# Altium schematic sheet Amplifier.SchDoc
size A; SheetNumber: 3; SheetTotal: 5
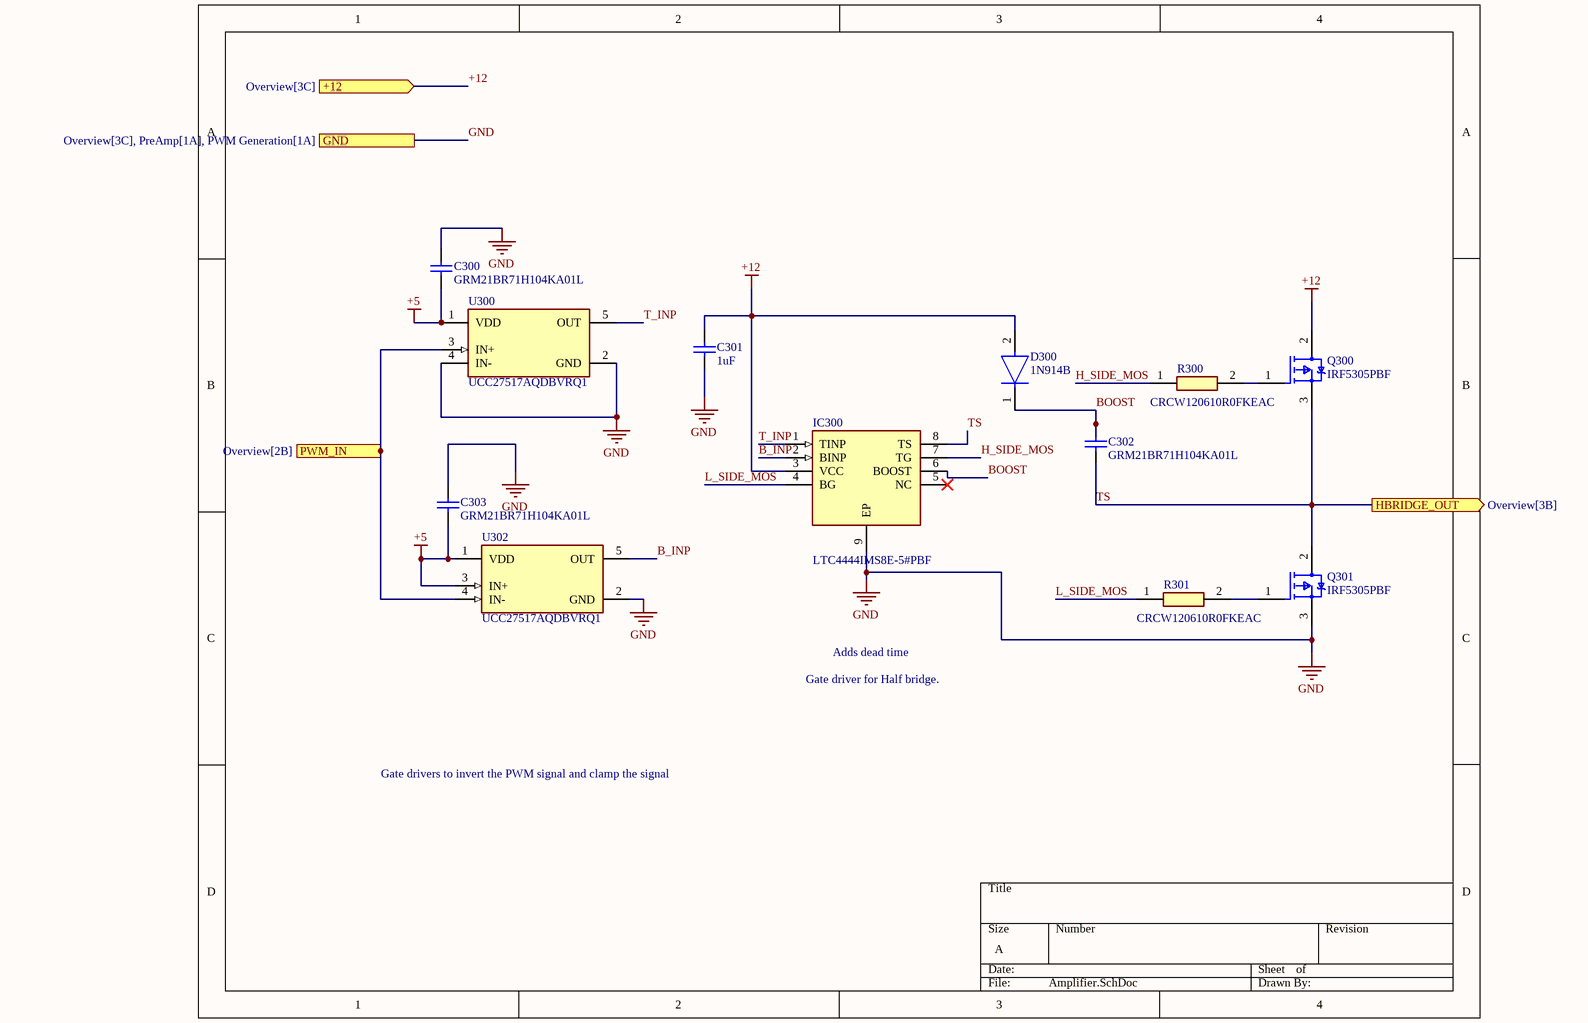
[diagram p0: Amplifier.SchDoc]

## Parts
C300  GRM21BR71H104KA01L  [CAPC2013X135X45ML10T25]
C301  1uF  [CAPC2013X140X50LL20T25]
C302  GRM21BR71H104KA01L  [CAPC2013X135X45ML10T25]
C303  GRM21BR71H104KA01L  [CAPC2013X135X45ML10T25]
D300  1N914B  [FP-017AG-MFG]
IC300  LTC4444IMS8E-5#PBF  [SOP65P490X110-9N]
Q300  IRF5305PBF  [FP-PG-TO220-3-0]
Q301  IRF5305PBF  [FP-PG-TO220-3-0]
R300  CRCW120610R0FKEAC  [RESC3216X60N]
R301  CRCW120610R0FKEAC  [RESC3216X60N]
U300  UCC27517AQDBVRQ1  [FP-DBV0005A-IPC_B]
U302  UCC27517AQDBVRQ1  [FP-DBV0005A-IPC_B]

## Ports
+12 (in, see Overview[3C]), GND (see Overview[3C], PreAmp[1A], PWM Generation[1A]), HBRIDGE_OUT (out, see Overview[3B]), PWM_IN (in, see Overview[2B])

## Nets
+5: C300.1 C303.1 U300.1(VDD) U302.1(VDD) U302.3(IN+)
+12: C301.1 D300.2(A) IC300.3(VCC) Q300.2(D) ; port +12
GND: C300.2 C301.2 C303.2 IC300.9(EP) Q301.3(S) U300.2(GND) U300.4(IN-) U302.2(GND) ; port GND
B_INP: IC300.2(BINP) U302.5(OUT)
BOOST: C302.2 D300.1(C) IC300.6(BOOST)
H_SIDE_MOS: IC300.7(TG) R300.1
L_SIDE_MOS: IC300.4(BG) R301.1
PWM_IN: U300.3(IN+) U302.4(IN-) ; port PWM_IN
T_INP: IC300.1(TINP) U300.5(OUT)
TS: C302.1 IC300.8(TS) Q300.3(S) Q301.2(D) ; port HBRIDGE_OUT
NetQ300_1: Q300.1(G) R300.2
NetQ301_1: Q301.1(G) R301.2

Not connected (* = marked no-connect by the designer): IC300 5(NC)*

## Notes on the sheet
- Gate driver for Half bridge.
- Adds dead time
- Gate drivers to invert the PWM signal and clamp the signal

## Library data of the parts
C300 C302 C303 = CMP-2100-03644-1: Chip Capacitor, 0.1 uF, +/- 10%, 50 V, -55 to 125 degC, 0805 (2012 Metric), RoHS, Tape and Reel; Manufacturer: Murata; Voltage: 50V; Capacitance: 100nF; Insulation Resistance: 10GR; Dielectric Material: Ceramic; Dielectric: X7R; Package Description: 2-Pin Surface Mount Device, Body 2 x 1.25 mm; Manufacturer URL: http://www.murata.com/; Case Code (Imperial): 0805; Datasheet URL: http://psearch.en.murata.com/capacitor/product/GRM21BR71H104KA01%23.pdf; Termination: SMD/SMT; Lead Free: LeadFree; Package Quantity: 1; Mount: SurfaceMount; REACH SVHC: Unknown; Thickness: 0.053inch; Height: 1.25mm; Case/Package: 0805; Voltage Rating: 50V; Width: 0.049inch; Case Code (Metric): 2012; Material: Ceramic; Min Operating Temperature: -55degC; RoHSCompliant: true; Datasheet Version: 42675.0; Voltage Rating (DC): 50V; Tolerance: 10%; Package Reference: 0805; Depth: 1.25mm; Length: 2mm; Max Operating Temperature: 125degC; Packaging: TapeandReel; Number of Pins: 2; Radiation Hardening: No
C301 = CMP-2007-03234-1: C0805C105K3RACTU; Manufacturer: Kemet; Part Number: C0805C105K3RACTU
D300 = CMP-07163-000001-1: DIODE GEN PURP 100V 200MA DO35; Manufacturer: ON Semiconductor; Forward Current: 300mA; Max Junction Temp: +175°C; Peak Reverse Current: 5uA; Value: 4pF; Max Surge Forward Current: 1A; Device Class L1: Discrete Semiconductors; Manufacturer Part Number: 1N914B; Automotive: No; Temperature: -55°C to +175°C; Temperature Range Low: -55°C; Reverse Voltage: 100V; Category: Diode; Footprint Url: https://www.onsemi.com/pub/Collateral/017AG.PDF; Package: 017AG; Lead Free: Yes; Digikey Description: DIODE GEN PURP 100V 200MA DO35; Height: 1.91mm; Device Class L3: Rectifier Diodes; ComponentLink2URL: https://www.onsemi.com/pub/Collateral/1N914-D.PDF; Octopart: https://octopart.com/1n914b-on+semiconductor-84323163; Capacitance: 4pF; Device Class L2: Diodes; Mouser Description: Diodes - General Purpose, Power, Switching 100V Io/200mA BULK; RoHS: TRUE; Max Repetitive Reverse Voltage: 100V; Temperature Range High: +175°C; ComponentLink2Description: Datasheet
IC300 = LTC4444IMS8E-5#PBF: Integrated Circuit; Manufacturer_Name: Analog Devices; Datasheet Link: http://cds.linear.com/docs/en/datasheet/4444fb.pdf; Height: 1.1mm; Manufacturer_Part_Number: LTC4444IMS8E-5#PBF; Mouser Part Number: 584-C4444IMS8E-5PBF; Mouser Price/Stock: https://www.mouser.co.uk/ProductDetail/Analog-Devices/LTC4444IMS8E-5PBF?qs=hVkxg5c3xu%2F0%252Bh2dIFcpbw%3D%3D; Arrow Part Number: LTC4444IMS8E-5#PBF; Arrow Price/Stock: https://www.arrow.com/en/products/ltc4444ims8e-5pbf/linear-technology
Q300 Q301 = CMP-32901-000003-1: MOSFET P-CH 55V 31A TO-220AB; Manufacturer: Infineon; Max Forward Diode Voltage: -1.3V; Continuous Drain Current: -31A; Standoff Height: 3.55mm; Power Dissipation: 110W; Number Of Channels: 1; Rthja Max: 62°C/W; Depletion Mode: False; Drain To Source Resistance: 0.06Ω; Input Capacitace At Vds: 1200pF @ -25V; Reverse Recovery Time: 71ns; Gate Charge At Vgs: 63nC @ -10V; Gate To Source Voltage: 20V; Turn Off Delay Time: 39ns; Turn On Delay Time: 14ns; Drain To Source Breakdown Voltage: -55V; Threshold Vgs Min: -2V; Max Junction Temp: +175°C; Pulse Drain Current: -110A; Reverse Recovery Charge: 170nC; Threshold Vgs Max: -4V; Device Class L1: Discrete Semiconductors; Lead Free: Yes; Temperature Range High: +175°C; Device Class L2: Transistors; Package: PG-TO220-3; Octopart: https://octopart.com/irf5305pbf-infineon-65873396; RoHS: TRUE; Number Of P Channels: 1; Manufacturer Part Number: IRF5305PBF; Category: Trans; Digikey Description: MOSFET P-CH 55V 31A TO-220AB; Device Class L3: MOSFETs; Height: 19.3mm; Automotive: No; Temperature Range Low: -55°C; Temperature: -55°C to +175°C; ComponentLink2URL: https://www.infineon.com/dgdl/irf5305pbf.pdf?fileId=5546d462533600a4015355e370101993; Drain To Source Voltage: -55V; ComponentLink2Description: Datasheet
R300 R301 = CRCW120610R0FKEAC: Resistor; Manufacturer_Name: Vishay; Datasheet Link: http://componentsearchengine.com/Datasheets/1/CRCW120610R0FKEAC.pdf; Height: 0.6mm; Manufacturer_Part_Number: CRCW120610R0FKEAC; Mouser Part Number: 71-CRCW120610R0FKEAC; Mouser Price/Stock: https://www.mouser.co.uk/ProductDetail/Vishay-Dale/CRCW120610R0FKEAC?qs=E3Y5ESvWgWOByB05FGvXRQ%3D%3D; Arrow Part Number: CRCW120610R0FKEAC; Arrow Price/Stock: https://www.arrow.com/en/products/crcw120610r0fkeac/vishay?utm_currency=USD&region=nac
U300 U302 = CMP-04912-000026-1: IC GATE DVR LOW SIDE 1CH SOT23-5; Max Output Current: 4A; Number of Outputs: 1; Channel Type: Single; Min Supply Voltage: 4.5V; Max Supply Voltage: 18V; Lead Free: Lead Free; Number of Channels: 1; Radiation Hardening: No; Packaging: Tape and Reel; Max Operating Temperature: 125°C; Number of Drivers: 1; Min Operating Temperature: -40°C; Case/Package: SOT-23-5; Number of Pins: 5; Package Quantity: 3000; Mount: Surface Mount